# EAGLE design justSwitches (EAGLE 9.6.2)
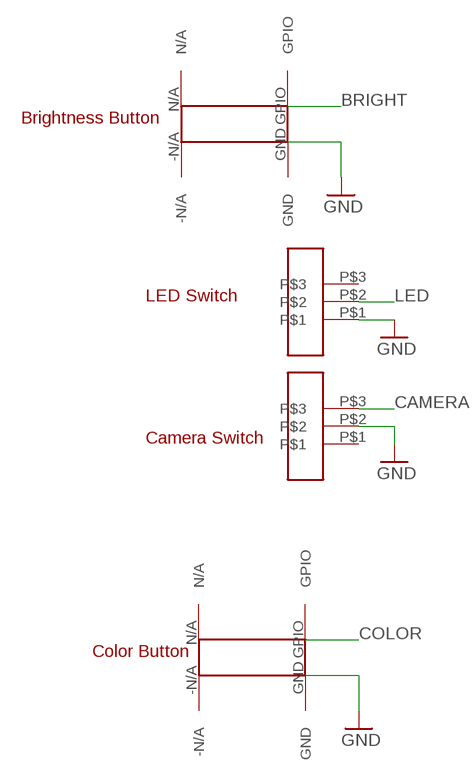
[diagram p0: schematic, sheet 1]

## Parts
U$2  G13-SW  [G13-SW]
U$3  G13-SW  [G13-SW]
U$6  G13-BUTTON  [G13-BUTTON]
U$7  G13-BUTTON  [G13-BUTTON]

## Nets
BRIGHT: U$6.GPIO
CAMERA: U$3.P$3
COLOR: U$7.GPIO
GND: U$2.P$1 U$3.P$2 U$6.GND U$7.GND
LED: U$2.P$2
Unconnected: U$2.P$3 U$3.P$1 U$6.-N/A U$6.N/A U$7.-N/A U$7.N/A

## Notes on the sheet
- Brightness Button
- LED Switch
- Camera Switch
- Color Button

## Library data of the parts
U$2 U$3 = raspberryPi4:G13-SW
U$6 U$7 = sumayyah:G13-BUTTON

## Board
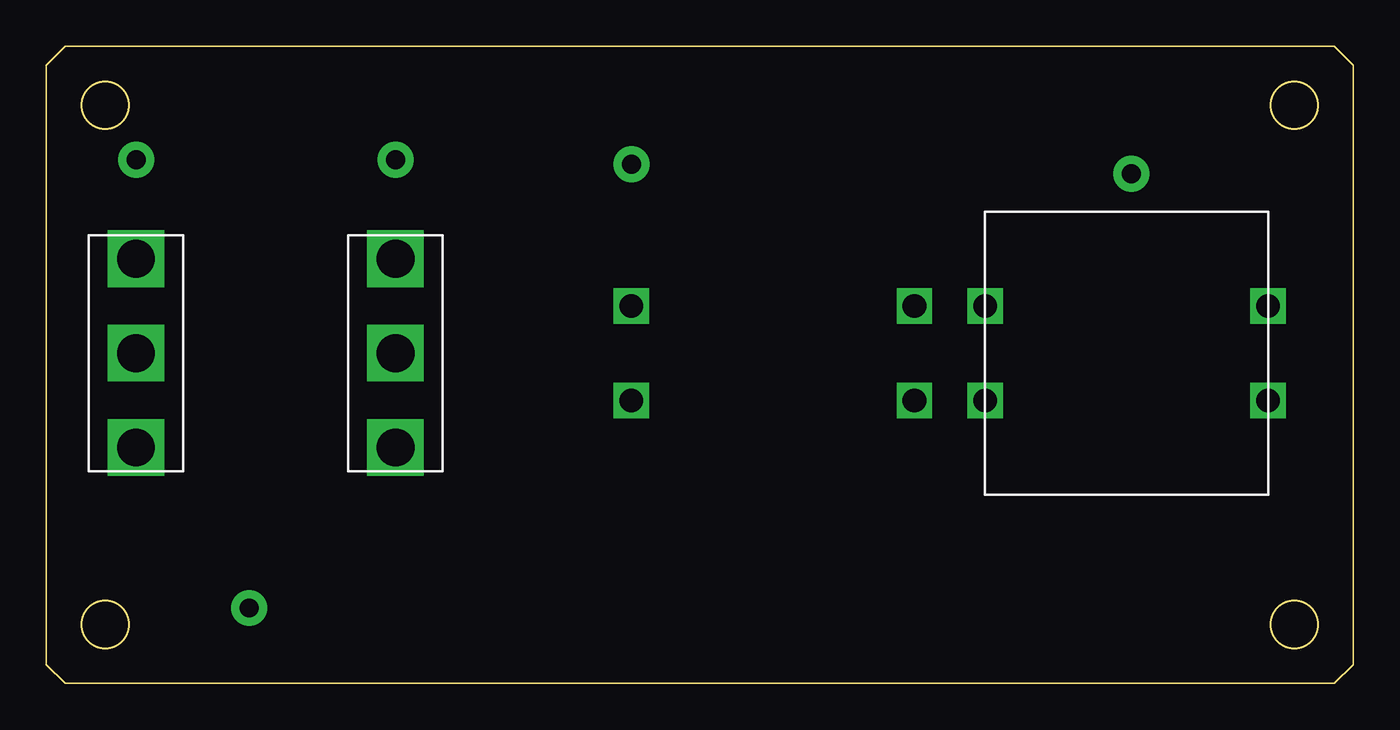
[diagram p1: board, top side]
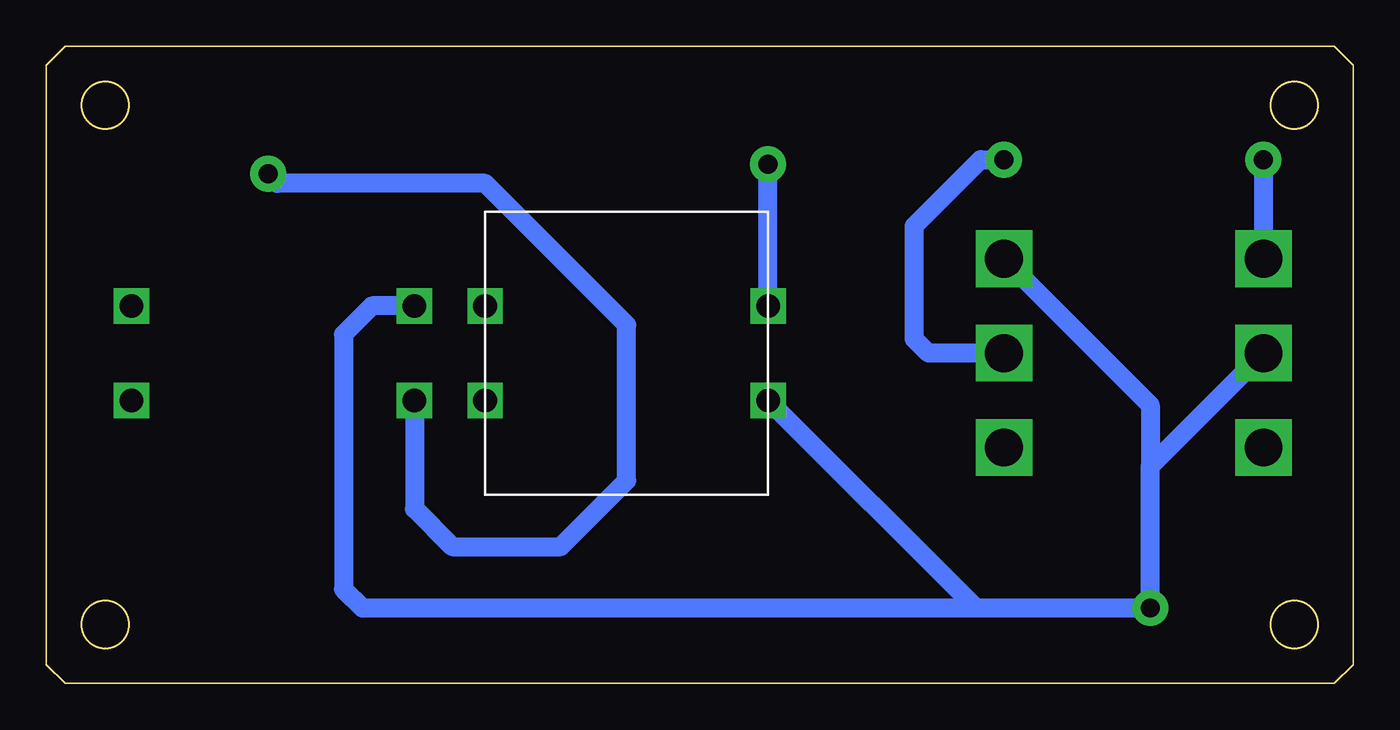
[diagram p2: board, bottom side, seen from below]

Size 70.36 x 34.29 mm. Coordinates in mm from the lower left corner, seen from the top.
Outline: 1.02,0 69.34,0 70.36,1.02 70.36,33.27 69.34,34.29 1.02,34.29 0,33.27 0,1.02 1.02,0
Outline: circle at 3.17,3.17 radius 1.27
Outline: circle at 3.17,31.11 radius 1.27
Outline: circle at 67.18,31.11 radius 1.27
Outline: circle at 67.18,3.17 radius 1.27
Copper layers (1*16): Top 0.035mm / dielectric 1.5mm / Bottom 0.035mm
Design rules "default": minimum track width 6mil, minimum drill 0.35mm, track to track 6mil, track to pad 6mil, pad to pad 6mil, via to via 6mil, smd to smd 6mil, copper to edge 40mil, drill to drill 6mil, minimum pad ring 10mil, minimum via ring 8mil, stop-mask expansion 4mil, vias tented up to drill 0mil, thermal gap 10mil

### Footprints (pad centres in the part's own frame; a part is rotated, then mirrored left to right if it is on the bottom)
G13-SW = drill 2.032 square: P$1 -5.08,0; P$2 0,0; P$3 5.08,0
G13-BUTTON = drill 1.27 square: -N/A -7.62,-2.54; GND 7.62,-2.54; GPIO 7.62,2.54; N/A -7.62,2.54

### Placement (x,y rotation side)
U$2  18.8,17.78 270 top
U$3  4.83,17.78 90 top
U$6  39.12,17.78 0 bottom
U$7  58.17,17.78 180 top

### Tracks (layer width: path | path; a pad name or v marks a point on that pad's centre or on a via)
BRIGHT  (via drill 1.02 pad 1.93)
  Bottom 1.016: U$6.GPIO v31.5,27.94
CAMERA  (via drill 1.02 pad 1.93)
  Bottom 1.016: v4.83,28.19 U$3.P$3
COLOR  (via drill 1.02 pad 1.93)
  Bottom 1.016: U$7.GPIO 50.55,9.4 48.51,7.37 42.67,7.37 39.12,10.92 39.12,19.3 46.74,26.92 57.91,26.92 v58.42,27.43
GND  (via drill 1.02 pad 1.93)
  Bottom 1.016: U$3.P$2 10.92,11.68 | 10.92,11.68 v10.92,4.06 20.32,4.06 | U$2.P$1 10.92,14.99 10.92,11.68 | U$6.GND 20.32,4.06 | U$7.GND 52.83,20.32 54.36,18.8 54.36,5.08 53.34,4.06 20.32,4.06
LED  (via drill 1.02 pad 1.93)
  Bottom 1.016: U$2.P$2 22.86,17.78 23.62,18.54 23.62,24.64 20.07,28.19 v18.8,28.19